# Altium schematic sheet Lightproject.SchDoc
size A
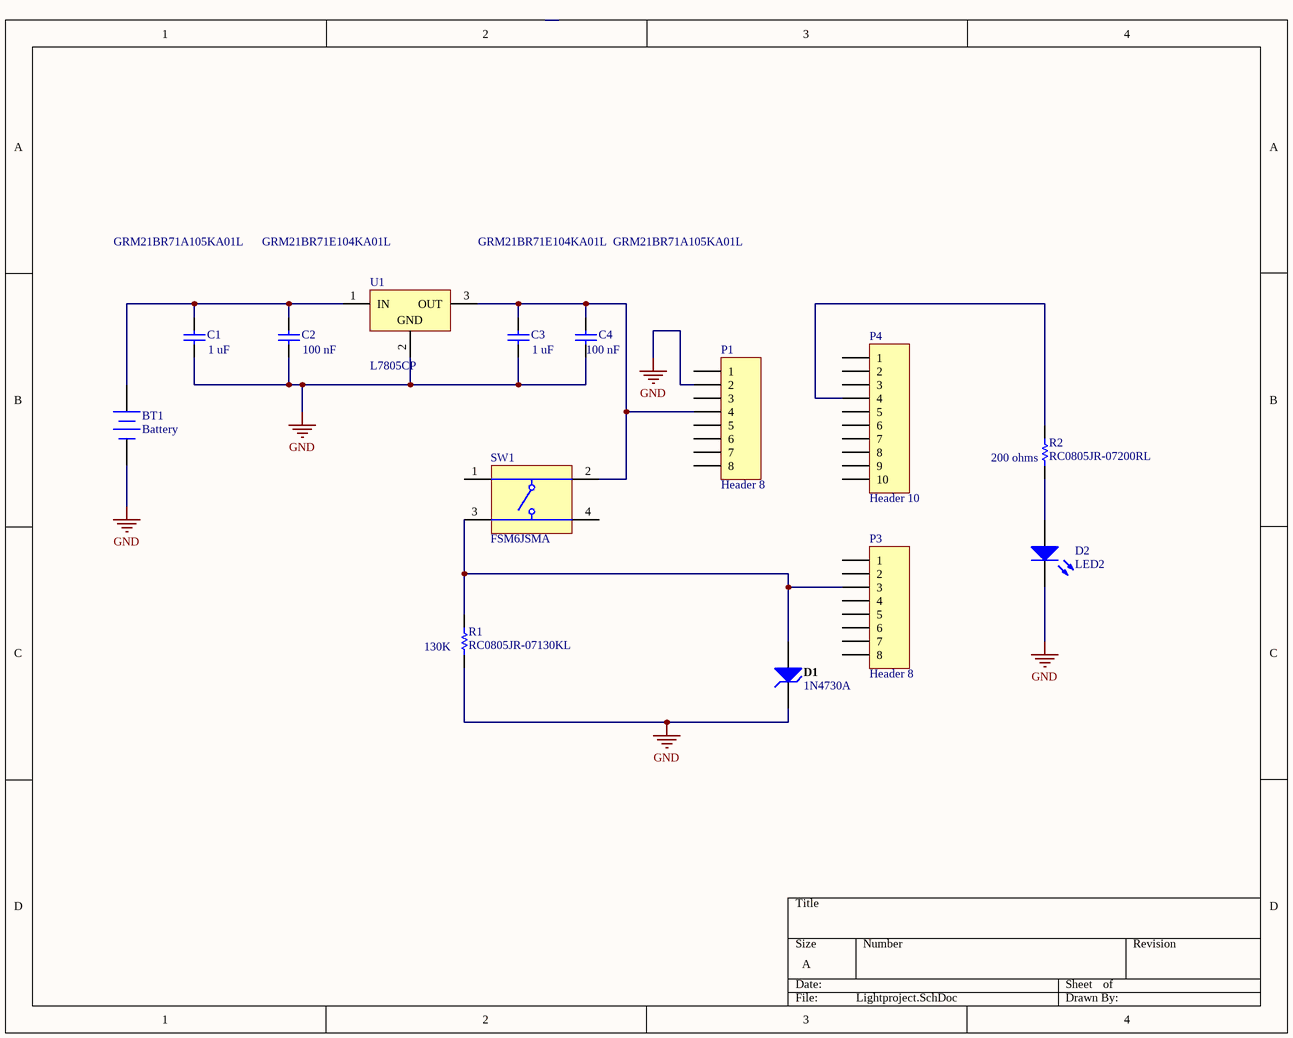
[diagram p0: Lightproject.SchDoc]

## Parts
BT1  Battery  [BAT-2]
C1  GRM21BR71A105KA01L  [CAPC2013X135X45NL10T25]
C2  GRM21BR71E104KA01L  [CAPC2013X135X50ML10T20]
C3  GRM21BR71E104KA01L  [CAPC2013X135X50ML10T20]
C4  GRM21BR71A105KA01L  [CAPC2013X135X45NL10T25]
D1  1N4730A  [FAIR-DO-41-2_V]
D2  LED2  [3.2X1.6X1.1]
P1  Header 8  [HDR1X8]
P3  Header 8  [HDR1X8]
P4  Header 10  [HDR1X10]
R1  RC0805JR-07130KL  [RESC2013X60X35NL10T20]
R2  RC0805JR-07200RL  [RESC2013X60X35ML10T20]
SW1  FSM6JSMA  [TECO-FSM6JSMA_V]
U1  L7805CP  [TO220FP]

## Nets
GND: BT1.2(-) C1.1 C2.1 C3.1 C4.1 D1.2(K) D2.2(K) P1.2 R1.1 U1.2(GND)
NetBT1_1: BT1.1(+) C1.2 C2.2 U1.1(IN)
NetC3_2: C3.2 C4.2 P1.4 SW1.2 U1.3(OUT)
NetD1_1: D1.1(A) P3.3 R1.2 SW1.3
NetD2_1: D2.1(A) R2.1
NetP4_4: P4.4 R2.2

Not connected (* = marked no-connect by the designer): P1 1 3 5 6 7 8; P3 1 2 4 5 6 7 8; P4 1 2 3 5 6 7 8 9 10; SW1 1 4

## Notes on the sheet
- (near C1) 1 uF
- (near C2) 100 nF
- (near C3) 1 uF
- (near C4) 100 nF
- (near R2) 200 ohms
- (near R1) 130K

## Library data of the parts
BT1 = Battery: Multicell Battery; Published: 24-Mar-1999; LatestRevisionDate: 17-Jul-2002; LatestRevisionNote: Re-released for DXP Platform.; PackageReference: BAT-2; Publisher: Altium Limited; PackageDescription: Battery; 2 Leads
C1 C4 = CMP-2007-03551-1: Manufacturer: Murata; Part Number: GRM21BR71A105KA01L
C2 C3 = CMP-2007-03456-1: Manufacturer: Murata; Part Number: GRM21BR71E104KA01L
D1 = CMP-0892-00029-1: Zener Diode, 3.9V, 1W, 5%, -65 to 200 degC, 2-Pin DO-41, Body 2.72 x 5.2 mm, RoHS; Manufacturer: Fairchild Semiconductor; Test Current IZ (mA): 64; ZZ (Max) (ohm): 9; IR (uA): 50; VZ (Min.) (V): 3.705; VZ (Max.) (V): 4.095; PD (W): 1; ComponentLink2Description: Datasheet; Operating and Storage Temperature Range: -65 to 200 degC; DatasheetVersion: Rev. H3; PackageReference: DO-41-2; ComponentLink3Description: Package Specification; RoHS: TRUE; PackageVersion: Rev. 2; PartNumber: 1N4730A; ComponentLink2URL: http://www.fairchildsemi.com/ds/1N/1N4744A.pdf; Tolerance: 5%; ComponentLink1Description: Manufacturer URL; ComponentLink1URL: http://www.fairchildsemi.com/; Mounting Technology: Through Hole; ComponentLink3URL: http://www.fairchildsemi.com/dwg/DO/DO41A.pdf; PackageDescription: 2-Pin Axial leaded, Body 2.72 x 5.2 mm, Lead Spread 25.4 mm
D2 = LED2: Typical RED, GREEN, YELLOW, AMBER GaAs LED; Published: 8-Jun-2000; LatestRevisionDate: 17-Jul-2002; LatestRevisionNote: Re-released for DXP Platform.; PackageVersion: Feb-2002; PackageReference: 3.2X1.6X1.1; Publisher: Altium Limited; PackageDescription: SM LED; 2 Flat Leads
P1 P3 = Header 8: Header, 8-Pin; LatestRevisionDate: 17-Jul-2002; LatestRevisionNote: Re-released for DXP Platform.; Publisher: Altium Limited
P4 = Header 10: Header, 10-Pin; LatestRevisionDate: 17-Jul-2002; LatestRevisionNote: Re-released for DXP Platform.; Publisher: Altium Limited
R1 = CMP-2001-01344-1: Manufacturer: Yageo; Part Number: RC0805JR-07130KL
R2 = CMP-2001-01354-1: Manufacturer: Yageo; Part Number: RC0805JR-07200RL
SW1 = CMP-2000-07503-1: Switch, SPST, 24 V, -35 to 85 degC, 4-Pin SMD, RoHS, Tape and Reel; Manufacturer: TE Connectivity; Electrical Life: 100000Cycles; Voltage Rating (DC): 24V; Contact Resistance: 100mOhm; Case\/Package: SMD/SMT; Actuator Length: 3.4mm; Contact Current Rating: 50mA; Operating Force: 1.57N; Max Voltage Rating (DC): 12V; Illumination Type: Illuminated; Actuator Material: Polyamide; Switch Travel: 0.25mm; Contact Plating: Silver; Mount: SurfaceMount; Contact Material: CopperAlloy; RoHSCompliant: true; Width: 6mm; Package Reference: FSM6JSMA; Manufacturer URL: http://www.te.com/; Min Operating Temperature: -35degC; REACH SVHC: Unknown; Datasheet Version: Rev. V, 02/2015; Package Quantity: 750; Voltage Rating: 24V; Termination: GullWing; Mechanical Life: 100000Cycles; Mounting Technology: SurfaceMount; Insulation Resistance: 100MOhm; Packaging: LoosePiece; Package Description: 4-Pin Surface Mount Device, Body 6 x 6 mm, Pitch 4.5 mm; Orientation: Straight; Max Operating Temperature: 85degC; Length: 6mm; Current Rating: 50mA; Datasheet URL: http://www.te.com/commerce/DocumentDelivery/DDEController?Action=showdoc&DocId=Customer+Drawing%7F2-1437565-7%7FV%7Fpdf%7FEnglish%7FENG_CD_2-1437565-7_V.pdf%7F4-1437565-9; Lead Free: LeadFree; ELV: Compliant; Throw Configuration: SPST
U1 = CMP-0244-00474-1: Positive Voltage Regulator, 5V, 3-Pin TO-220FP; ComponentLink1Description: Manufacturer URL; ComponentLink2Description: Datasheet; DatasheetVersion: 16/11/2011; PackageDescription: TO, Thru-Hole, Vertical, Heatsink Mounted; 3 In-Line Leads; Pitch 2.54 mm; ComponentLink2URL: http://www.st.com/internet/com/TECHNICAL_RESOURCES/TECHNICAL_LITERATURE/DATASHEET/CD00000444.pdf; ComponentLink1URL: http://www.st.com; PackageVersion: 2011; PackageReference: TO220FP